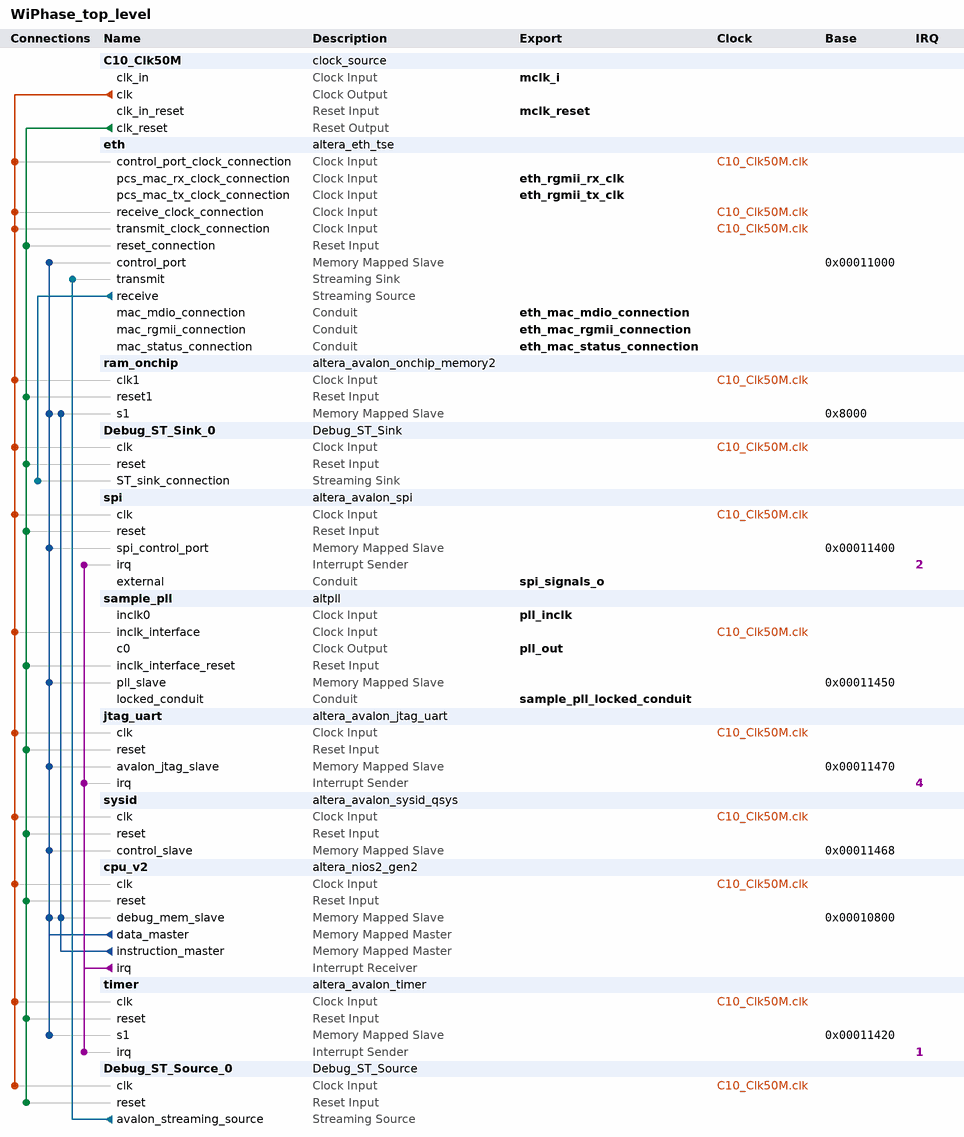
[diagram p0: system contents]
# Platform Designer (Qsys) system WiPhase_top_level, Cyclone 10 LP 10CL025YU256C8G
# Parameters at their usual value, and those the tool derives, are not listed.
package require -exact qsys 17.1
create_system WiPhase_top_level
set_project_property DEVICE_FAMILY {Cyclone 10 LP}
set_project_property DEVICE 10CL025YU256C8G

add_instance C10_Clk50M clock_source 17.1
set_instance_parameter_value C10_Clk50M clockFrequency 50000000

add_instance eth altera_eth_tse 17.1
set_instance_parameter_value eth XCVR_RCFG_JTAG_ENABLE 0
set_instance_parameter_value eth XCVR_SET_CAPABILITY_REG_ENABLE 0
set_instance_parameter_value eth XCVR_SET_CSR_SOFT_LOGIC_ENABLE 0
set_instance_parameter_value eth XCVR_SET_PRBS_SOFT_LOGIC_ENABLE 0
set_instance_parameter_value eth XCVR_SET_USER_IDENTIFIER 0
set_instance_parameter_value eth core_variation MAC_ONLY
set_instance_parameter_value eth eg_addr 9
set_instance_parameter_value eth enable_hd_logic false
set_instance_parameter_value eth enable_mac_flow_ctrl false
set_instance_parameter_value eth enable_magic_detect true
set_instance_parameter_value eth enable_shift16 true
set_instance_parameter_value eth ifGMII RGMII
set_instance_parameter_value eth ing_addr 10
set_instance_parameter_value eth mdio_clk_div 40
set_instance_parameter_value eth stat_cnt_ena true
set_instance_parameter_value eth transceiver_type NONE

add_instance ram_onchip altera_avalon_onchip_memory2 17.1
set_instance_parameter_value ram_onchip dataWidth 32
set_instance_parameter_value ram_onchip dualPort false
set_instance_parameter_value ram_onchip initMemContent true
set_instance_parameter_value ram_onchip initializationFileName C:/Users/alist/OneDrive/Electrickery/Phased-Array-Radio-Telescope/Phased-Array-WiFi-Camera/FPGA_Firmware/software/ocram_boot/mem_init/WiPhase_top_level_data_ram_onchip.hex
set_instance_parameter_value ram_onchip memorySize 20480

add_instance Debug_ST_Sink_0 Debug_ST_Sink 1.0

add_instance spi altera_avalon_spi 17.1
set_instance_parameter_value spi clockPolarity 0
set_instance_parameter_value spi dataWidth 8
set_instance_parameter_value spi insertDelayBetweenSlaveSelectAndSClk true
set_instance_parameter_value spi masterSPI true
set_instance_parameter_value spi numberOfSlaves 3
set_instance_parameter_value spi targetClockRate 50000
set_instance_parameter_value spi targetSlaveSelectToSClkDelay 100000.0

add_instance sample_pll altpll 17.1
set_instance_parameter_value sample_pll AVALON_USE_SEPARATE_SYSCLK YES
set_instance_parameter_value sample_pll CLK0_DIVIDE_BY 1
set_instance_parameter_value sample_pll CLK0_MULTIPLY_BY 2
set_instance_parameter_value sample_pll INCLK0_INPUT_FREQUENCY 20000
set_instance_parameter_value sample_pll PORT_ARESET PORT_UNUSED
set_instance_parameter_value sample_pll PORT_LOCKED PORT_USED
set_instance_parameter_value sample_pll PORT_clk1 PORT_UNUSED
set_instance_parameter_value sample_pll PORT_clk2 PORT_UNUSED
set_instance_parameter_value sample_pll PORT_clk3 PORT_UNUSED

add_instance jtag_uart altera_avalon_jtag_uart 17.1
set_instance_parameter_value jtag_uart simInteractiveOptions NO_INTERACTIVE_WINDOWS

add_instance sysid altera_avalon_sysid_qsys 17.1
set_instance_parameter_value sysid id 305419896

add_instance cpu_v2 altera_nios2_gen2 17.1
set_instance_parameter_value cpu_v2 dcache_size 2048
set_instance_parameter_value cpu_v2 exceptionSlave ram_onchip.s1
set_instance_parameter_value cpu_v2 icache_size 2048
set_instance_parameter_value cpu_v2 impl Tiny
set_instance_parameter_value cpu_v2 resetSlave ram_onchip.s1
set_instance_parameter_value cpu_v2 setting_branchpredictiontype Static

add_instance timer altera_avalon_timer 17.1
set_instance_parameter_value timer period 1
set_instance_parameter_value timer periodUnits MSEC

add_instance Debug_ST_Source_0 Debug_ST_Source 1.0

# connections
add_connection C10_Clk50M.clk cpu_v2.clk clock
add_connection C10_Clk50M.clk Debug_ST_Sink_0.clk clock
add_connection C10_Clk50M.clk Debug_ST_Source_0.clk clock
add_connection C10_Clk50M.clk eth.control_port_clock_connection clock
add_connection C10_Clk50M.clk eth.receive_clock_connection clock
add_connection C10_Clk50M.clk eth.transmit_clock_connection clock
add_connection C10_Clk50M.clk jtag_uart.clk clock
add_connection C10_Clk50M.clk ram_onchip.clk1 clock
add_connection C10_Clk50M.clk sample_pll.inclk_interface clock
add_connection C10_Clk50M.clk spi.clk clock
add_connection C10_Clk50M.clk sysid.clk clock
add_connection C10_Clk50M.clk timer.clk clock
add_connection C10_Clk50M.clk_reset cpu_v2.reset reset
add_connection C10_Clk50M.clk_reset Debug_ST_Sink_0.reset reset
add_connection C10_Clk50M.clk_reset Debug_ST_Source_0.reset reset
add_connection C10_Clk50M.clk_reset eth.reset_connection reset
add_connection C10_Clk50M.clk_reset jtag_uart.reset reset
add_connection C10_Clk50M.clk_reset ram_onchip.reset1 reset
add_connection C10_Clk50M.clk_reset sample_pll.inclk_interface_reset reset
add_connection C10_Clk50M.clk_reset spi.reset reset
add_connection C10_Clk50M.clk_reset sysid.reset reset
add_connection C10_Clk50M.clk_reset timer.reset reset
add_connection cpu_v2.data_master cpu_v2.debug_mem_slave avalon
set_connection_parameter_value cpu_v2.data_master/cpu_v2.debug_mem_slave baseAddress 0x00010800
add_connection cpu_v2.data_master eth.control_port avalon
set_connection_parameter_value cpu_v2.data_master/eth.control_port baseAddress 0x00011000
add_connection cpu_v2.data_master jtag_uart.avalon_jtag_slave avalon
set_connection_parameter_value cpu_v2.data_master/jtag_uart.avalon_jtag_slave baseAddress 0x00011470
add_connection cpu_v2.data_master ram_onchip.s1 avalon
set_connection_parameter_value cpu_v2.data_master/ram_onchip.s1 baseAddress 0x8000
add_connection cpu_v2.data_master sample_pll.pll_slave avalon
set_connection_parameter_value cpu_v2.data_master/sample_pll.pll_slave baseAddress 0x00011450
add_connection cpu_v2.data_master spi.spi_control_port avalon
set_connection_parameter_value cpu_v2.data_master/spi.spi_control_port baseAddress 0x00011400
add_connection cpu_v2.data_master sysid.control_slave avalon
set_connection_parameter_value cpu_v2.data_master/sysid.control_slave baseAddress 0x00011468
add_connection cpu_v2.data_master timer.s1 avalon
set_connection_parameter_value cpu_v2.data_master/timer.s1 baseAddress 0x00011420
add_connection cpu_v2.instruction_master cpu_v2.debug_mem_slave avalon
set_connection_parameter_value cpu_v2.instruction_master/cpu_v2.debug_mem_slave baseAddress 0x00010800
add_connection cpu_v2.instruction_master ram_onchip.s1 avalon
set_connection_parameter_value cpu_v2.instruction_master/ram_onchip.s1 baseAddress 0x8000
add_connection Debug_ST_Source_0.avalon_streaming_source eth.transmit avalon_streaming
add_connection eth.receive Debug_ST_Sink_0.ST_sink_connection avalon_streaming
add_connection cpu_v2.irq jtag_uart.irq interrupt
set_connection_parameter_value cpu_v2.irq/jtag_uart.irq irqNumber 4
add_connection cpu_v2.irq spi.irq interrupt
set_connection_parameter_value cpu_v2.irq/spi.irq irqNumber 2
add_connection cpu_v2.irq timer.irq interrupt
set_connection_parameter_value cpu_v2.irq/timer.irq irqNumber 1

# exported interfaces
add_interface eth_mac_mdio_connection conduit end
set_interface_property eth_mac_mdio_connection EXPORT_OF eth.mac_mdio_connection
add_interface eth_mac_rgmii_connection conduit end
set_interface_property eth_mac_rgmii_connection EXPORT_OF eth.mac_rgmii_connection
add_interface eth_mac_status_connection conduit end
set_interface_property eth_mac_status_connection EXPORT_OF eth.mac_status_connection
add_interface eth_rgmii_rx_clk clock sink
set_interface_property eth_rgmii_rx_clk EXPORT_OF eth.pcs_mac_rx_clock_connection
add_interface eth_rgmii_tx_clk clock sink
set_interface_property eth_rgmii_tx_clk EXPORT_OF eth.pcs_mac_tx_clock_connection
add_interface mclk_i clock sink
set_interface_property mclk_i EXPORT_OF C10_Clk50M.clk_in
add_interface mclk_reset reset sink
set_interface_property mclk_reset EXPORT_OF C10_Clk50M.clk_in_reset
add_interface pll_inclk clock sink
set_interface_property pll_inclk EXPORT_OF sample_pll.inclk0
add_interface pll_out clock source
set_interface_property pll_out EXPORT_OF sample_pll.c0
add_interface sample_pll_locked_conduit conduit end
set_interface_property sample_pll_locked_conduit EXPORT_OF sample_pll.locked_conduit
add_interface spi_signals_o conduit end
set_interface_property spi_signals_o EXPORT_OF spi.external

set_interconnect_requirement {$system} qsys_mm.clockCrossingAdapter HANDSHAKE
set_interconnect_requirement {$system} qsys_mm.enableEccProtection FALSE
set_interconnect_requirement {$system} qsys_mm.insertDefaultSlave FALSE
set_interconnect_requirement {$system} qsys_mm.maxAdditionalLatency 1

save_system WiPhase_top_level.qsys
